# Altium schematic sheet usb_485.SchDoc
size A
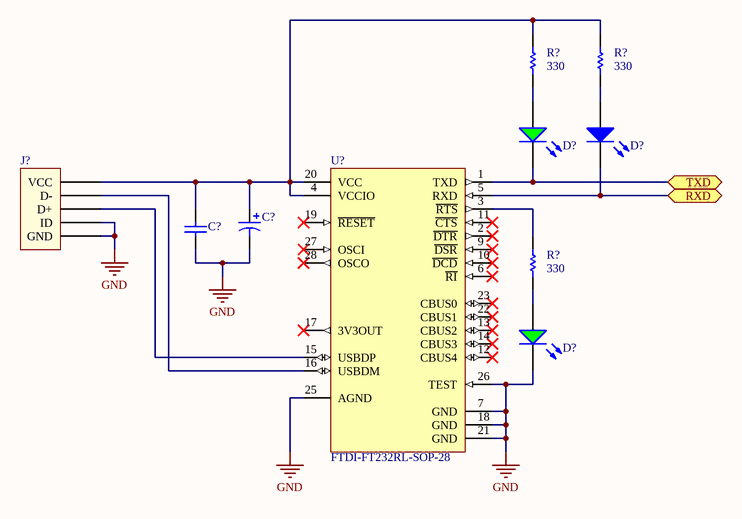
[diagram p0: usb_485.SchDoc]

## Parts
(Parts that share a designator on the sheet are numbered #1, #2 ... from top to bottom, then left to right.)
C?#1  CAP-2  [CAPC1005X56X25ML10T15]  (value not drawn)
C?#2  Cap Pol2  [PCB-egxxoj2f8mz0uec15l92-1]  (value not drawn)
D?#1  LED  [0603D]  (value not drawn)
D?#2  SYM-ec4c254b98bc338b-2  [PCB-9uwk2xd6chnjs8ehct7l-1]  (value not drawn)
D?#3  SYM-ec4c254b98bc338b-2  [PCB-9uwk2xd6chnjs8ehct7l-1]  (value not drawn)
J?  Samtec SPM-05-S-B-RA-PF  [PCB-zq8ywneimcsz1qyvw1ex-1]  (value not drawn)
R?#1  330  [PCB-1852941-1]
R?#2  330  [PCB-1852941-1]
R?#3  330  [PCB-1852941-1]
U?  FTDI-FT232RL-SOP-28  [SOP65P780X200-28N]

## Ports
RXD (bidir), TXD (bidir)

## Nets
GND: C?#1.2 C?#2.2 D?#3.C J?.4(ID) J?.5(GND) U?.7(GND) U?.18(GND) U?.21(GND) U?.25(AGND) U?.26(TEST)
RXD: D?#1.K U?.5(RXD) ; port RXD
TXD: D?#2.C U?.1(TXD) ; port TXD
NetC?#1_1: C?#1.1 C?#2.1 J?.1(VCC) R?#1.2 R?#2.2 U?.4(VCCIO) U?.20(VCC)
NetD?#1_A: D?#1.A R?#2.1
NetD?#2_A: D?#2.A R?#1.1
NetD?#3_A: D?#3.A R?#3.1
NetJ?_2: J?.2(D-) U?.16(USBDM)
NetJ?_3: J?.3(D+) U?.15(USBDP)
NetR?#3_2: R?#3.2 U?.3(~{RTS})

Not connected (* = marked no-connect by the designer): U? 2(~{DTR})* 6(~{RI})* 9(~{DSR})* 10(~{DCD})* 11(~{CTS})* 12(CBUS4)* 13(CBUS2)* 14(CBUS3)* 17(3V3OUT)* 19(~{RESET})* 22(CBUS1)* 23(CBUS0)* 27(OSCI)* 28(OSCO)*

## Library data of the parts
C?#1 = CMP-125960-4: AVX   0402ZD104KAT2A   CAP, MLCC, X5R, 100NF, 10V, 0402
C?#2 = CMP-7994653-3: CAPACITOR TANT, 1UF, 16V, SMD; Capacitance: 1µF; Capacitance Tolerance: ± 20%; Voltage Rating: 16VDC; ESR: 10ohm; No....; Manufacturer Part Number: F981C105MMA; Lead-Free Status: Lead Free; Voltage Rating (DC): 16.0 V; Mounting Style: Surface Mount; Number of Pins: 2; Size-Height: 800 µm; OctopartID: 5dd3957d11448214; Capacitance Tolerance: ±20%; RoHS: Compliant; Packaging: Cut Tape (CT); Octopart URL: http://octopart.com/f981c105mma-avx-27552241
D?#1 = CMP-1544913-11: 598 Series 0603 - 1.6 x 0.8 mm Red 140° 40 mcd Surface Mount Micro LED
D?#2 D?#3 = CMP-ec4c254b98bc338b-4: Led; 0603 Smt Led, Green, Alingap, Water Clear Lens, 140 Deg Viewing Angle; Case/Package (SI): 1608; Lead-Free Status: Lead Free; Size-Height: 700 µm; Octopart URL: http://octopart.com/598-8070-107f-dialight-872854; Size-Length: 1.60 mm; Number of Pins: 2
J? = CMP-d3c01be030ed0c07-1: Conn USB M 5 POS Solder RA Thru-Hole 5 Terminal 1 Port; Gender: Male; Octopart URL: http://octopart.com/spm-05-s-b-ra-pf-samtec-19580491; Manufacturer Part Number: SPM-05-S-B-RA-PF; Mounting Style: Through Hole, Solder; Packaging: Bulk; OctopartID: d3c01be030ed0c07
R?#1-R?#3 = CMP-1852941-3: RESISTOR, RC21 0603 330R; Manufacturer Part Number: RC0603JR-07330RL; Voltage Rating (DC): 50.0 V; Resistance Tolerance: ±5%; Power Rating: 0.1 W; Lead-Free Status: Lead Free; Size-Width: 0.0008 m; RoHS: Compliant; Octopart Url: https://octopart.com/rc0603jr-07330rl-yageo-39803615; Size-Height: 0.00045 m; Size-Length: 0.0016 m; OctopartID: 0b82c0d7743bd445; Mounting Style: Surface Mount; REACH SVHC Compliance: No SVHC; Case/Package: 0603; Number of Pins: 2; Resistance: 330
U? = CMP-1159378-16: SMD IC Interface; USB to UART; Speed 300b-3Mbaud; VCC 1.8V-5.25V; Supply Voltage (DC): 1.80 V (min); Lead-Free Status: Lead Free; Data Rate: 3.00 Mbps; Supply Current: 15.0 mA; OctopartID: bcc675ec4d616301; Manufacturer Part Number: FT232RL; RoHS: Compliant; Number of Pins: 28; Octopart URL: http://octopart.com/ft232rl-ftdi-2151617; Packaging: Tube; Mounting Style: Surface Mount; REACH SVHC Compliance: No SVHC